# Altium schematic sheet SENSOR.SchDoc
size A4
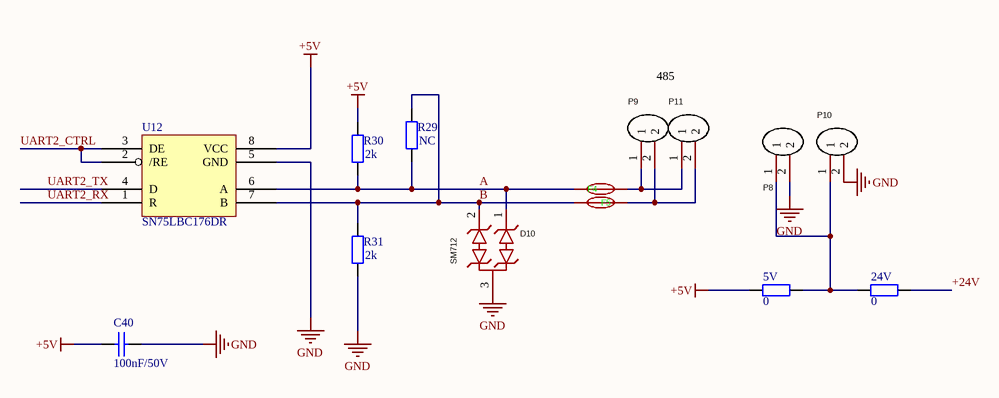
[diagram p0: SENSOR.SchDoc]

## Parts
5V  0  [R-0805]
24V  0  [R-0805]
C40  100nF/50V  [C-0805]
D10  SM712  [SOT-23-3]
F4  SMD1206-020-48  [F1206]  (value not drawn)
F5  SMD1206-020-48  [F1206]  (value not drawn)
P8  WJ500V-5.08-2P  [KF128-2P DG128]  (value not drawn)
P9  WJ500V-5.08-2P  [KF128-2P DG128]  (value not drawn)
P10  WJ500V-5.08-2P  [KF128-2P DG128]  (value not drawn)
P11  WJ500V-5.08-2P  [KF128-2P DG128]  (value not drawn)
R29  NC  [R-0805]
R30  2k  [R-0805]
R31  2k  [R-0805]
U12  SN75LBC176DR  [SOP-8]

## Nets
+5V: 5V.2 C40.1 R30.2 U12.8(VCC)
GND: C40.2 D10.3 P8.2 P10.2 R31.1 U12.5(GND)
+24V: 24V.1
A: D10.1 F4.1 R29.1 R30.1 U12.6(A)
B: D10.2 F5.1 R29.2 R31.2 U12.7(B)
UART2_CTRL: U12.2(/RE) U12.3(DE)
UART2_RX: U12.1(R)
UART2_TX: U12.4(D)
Net5V_1: 5V.1 24V.2 P8.1 P10.1
NetF4_2: F4.2 P9.1 P11.1
NetF5_2: F5.2 P9.2 P11.2

## Notes on the sheet
- 485

## Library data of the parts
5V 24V R29-R31 = RES: 电阻; Value: 5.1K; Published: 8-Jun-2000; LatestRevisionDate: 17-Jul-2002; LatestRevisionNote: Re-released for DXP Platform.; PackageReference: AXIAL-0.4; Publisher: Altium Limited
C40 = C普通电容: 电容
D10 = SM712_C7420375: Manufacturer: 宏迦橙; Add into BOM: yes; polarity: 双向; Reverse Stand-Off Voltage (Vrwm): 12V；7V; Maximum Clamping Voltage: 15V; Peak Pulse Current (Ipp): 12A; Peak Pulse Power Dissipation (Ppp): 300W; Breakdown Voltage: 7.5V；13.5V; Reverse Leakage Current (Ir): 100nA; Number of Lines: 双路; Type: ESD; Symbol: SM712_C7420375; Device: SM712_C7420375; LCSC Part Name: 丝印:7AM; Supplier Part: C7420375; Manufacturer Part: SM712; Supplier Footprint: SOT-23; JLCPCB Part Class: Extended Part; Datasheet: https://atta.szlcsc.com/upload/public/pdf/source/20230828/0FC27A1088C52CC912446121FEA414EC.pdf; Supplier: LCSC; Convert to PCB: yes; Operating Temperature: -55℃~125℃
F4 F5 = SMD1206-020-48: Manufacturer: 宏嘉诚; Add into BOM: yes; Voltage - Max: 48V; Current - Max: 40A; Hold Current: 200mA; Trip Current: 460mA; Power Dissipation: 600mW; Resistance - Initial (Ri) (Min): 350mΩ; Resistance - Post Trip (R1) (Max): 2.7Ω; Time to Trip(Max): 100ms; Symbol: SMD1206-020-48; Device: SMD1206-020-48; LCSC Part Name: SMD1206-020-48; Supplier Part: C46641003; Manufacturer Part: SMD1206-020-48; Supplier Footprint: 1206; JLCPCB Part Class: Extended Part; Datasheet: https://atta.szlcsc.com/upload/public/pdf/source/20250414/5AC46D2F961B725C9DB708C91B04DBEC.pdf; Supplier: LCSC; Convert to PCB: yes
P8-P11 = WJ500V-5.08-2P: Manufacturer: KANGNEX(康奈克斯电气); Symbol: WJ500V-5.08-2P-14-00A; Add into BOM: yes; Pitch: 5.08mm; Structure: 1x2P; Number of PINs Per Row: 2; Current Rating (Max): 18A; Voltage Rating (Max): 250V; Wire Gauge - AWG: 14~30; Wire Gauge - mm2: 2.5; Name: WJ500V-5.08-2P; Device: WJ500V-5.08-2P; LCSC Part Name: 5.08mm 1x2P 排数:1 每排P数:2 直针 可拼接; Supplier Part: C8465; Manufacturer Part: WJ500V-5.08-2P; Supplier Footprint: 插件,P=5.08mm; JLCPCB Part Class: Extended Part; Datasheet: https://atta.szlcsc.com/upload/public/pdf/source/20191225/C8465_02D34CE5B5B4A53DF5891601D97FA9F4.pdf; Supplier: LCSC; Convert to PCB: yes; Number of Rows: 1; Mounting Style: 直针; Operating Temperature Range: -40℃~+105℃; Color: 绿色
U12 = 75LBC176: 芯片